# EAGLE design upper (EAGLE 9.4.2)
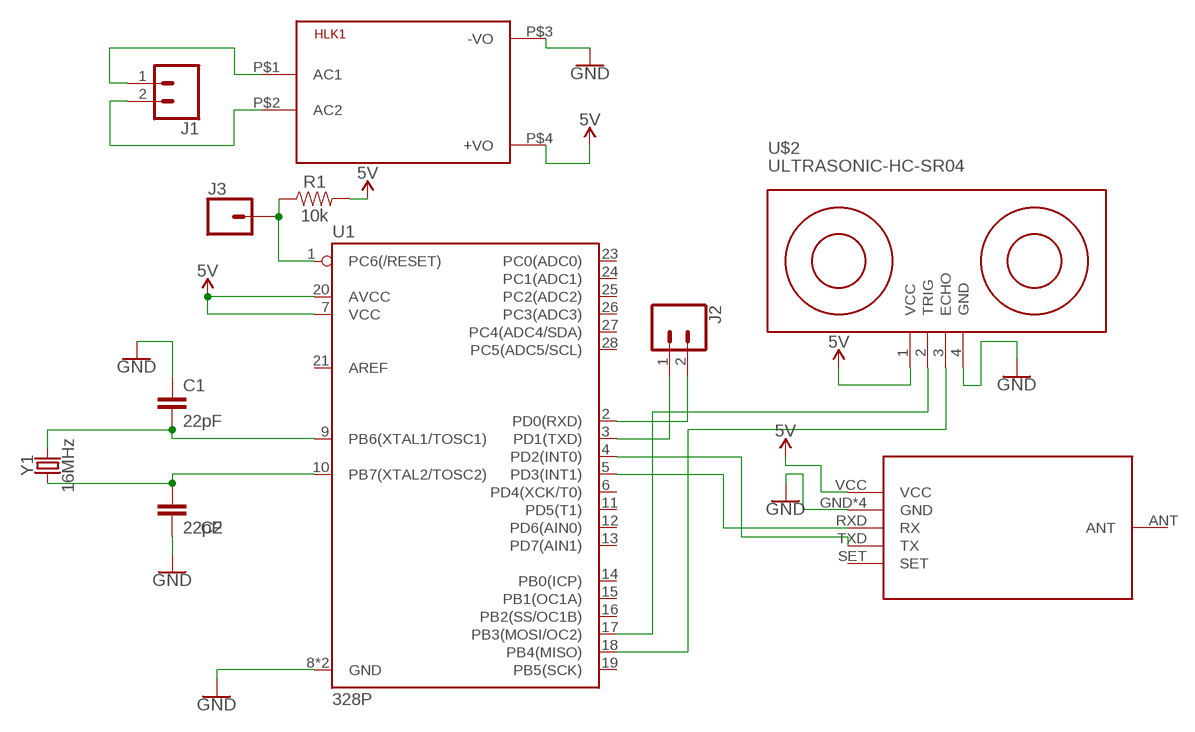
[diagram p0: schematic, sheet 1]

## Parts
C1  22pF  22PF-PTH-2.54MM-200V-5%  [CAP-PTH-2.54]
C2  22pF  22PF-PTH-2.54MM-200V-5%  [CAP-PTH-2.54]
HLK1  HLK-PM013W  [HLK-PM01]
J1  CONN_025MM  [SCREWTERMINAL-5MM-2]
J2  CONN_025MM  [SCREWTERMINAL-5MM-2]
J3  CONN_01  [1X01]
R1  10k  10KOHM-HORIZ-1/4W-1%  [AXIAL-0.3]
U1  328P  ATMEGA328P_PDIP  [DIP28]
U$1  HC-12_FOOTPRINT  [HC-12_FOOTPRINT]
U$2  ULTRASONIC-HC-SR04  [ULTRASONIC-HC-SR04]
Y1  16MHz  CRYSTAL-16MHZPTH-HC49US  [HC49US]

## Nets
5V: HLK1.P$4(+VO) R1.P$2 U1.7(VCC) U1.20(AVCC) U$1.VCC U$2.1(VCC)
GND: C1.1 C2.2 HLK1.P$3(-VO) U1.8(GND) U1.22(GND) U$1.GND U$1.GND1(GND) U$1.GND2(GND) U$1.MCHFIX(GND) U$2.4(GND)
N$1: U1.4(PD2(INT0)) U$1.TXD(TX)
N$2: U1.17(PB3(MOSI/OC2)) U$2.2(TRIG)
N$3: U1.18(PB4(MISO)) U$2.3(ECHO)
N$4: U1.5(PD3(INT1)) U$1.RXD(RX)
N$5: HLK1.P$2(AC2) J1.2
N$6: HLK1.P$1(AC1) J1.1
N$7: J3.1 R1.P$1 U1.1(PC6(/RESET))
N$8: J2.1 U1.3(PD1(TXD))
N$9: J2.2 U1.2(PD0(RXD))
N$10: C1.2 U1.9(PB6(XTAL1/TOSC1)) Y1.2
N$11: C2.1 U1.10(PB7(XTAL2/TOSC2)) Y1.1
Unconnected: U1.6(PD4(XCK/T0)) U1.11(PD5(T1)) U1.12(PD6(AIN0)) U1.13(PD7(AIN1)) U1.14(PB0(ICP)) U1.15(PB1(OC1A)) U1.16(PB2(SS/OC1B)) U1.19(PB5(SCK)) U1.21(AREF) U1.23(PC0(ADC0)) U1.24(PC1(ADC1)) U1.25(PC2(ADC2)) U1.26(PC3(ADC3)) U1.27(PC4(ADC4/SDA)) U1.28(PC5(ADC5/SCL)) U$1.ANT U$1.SET

## Library data of the parts
C1 C2 = SparkFun-Capacitors:22PF: 22pF ceramic capacitors A capacitor is a passive two-terminal electrical component used to store electrical energy temporarily in an electric field.; PROD_ID: CAP-09128
HLK1 = HLK-PM01:HLK-PM01: Hi-Link Power Supply HLK-PM01 3W Author: Ahmed Said <https://github.com/AhmedSaid/EAGLELibraries>
J1 J2 = SparkFun-Connectors:CONN_02: Multi connection point. Often used as Generic Header-pin footprint for 0.1 inch spaced/style header connections On any of the 0.1 inch spaced packages, you can populate with these: Break Away Headers - Straight <https://www.sparkfun.com/products/116> (PRT-00116) Break Away Male Headers - Right Angle <https://www.sparkfun.com/products/553> (PRT-00553) Female Headers <https://www.sparkfun.com/products/115> (PRT-00115) Break Away Headers - Machine Pin <https://www.sparkfun.com/products/117> (PRT-00117) Break Away Female Headers - Swiss Machine Pin <https://www.sparkfun.com/products/743> (PRT-00743) For SCREWTERMINALS and SPRING TERMINALS visit here: Screw Terimnals on SparkFun.com <https://www.sparkfun.com/search/results?term=Screw+Terminals> (5mm/3.5mm/2.54mm spacing) This device is also useful as a general connection point to wire up your design to another part of your project. Our various solder wires solder well into these plated through hole pads. Hook-Up Wire - Assortment (Stranded, 22 AWG) <https://www.sparkfun.com/products/11375> (PRT-11375) Hook-Up Wire - Assortment (Solid Core, 22 AWG) <https://www.sparkfun.com/products/11367> (PRT-11367) View the entire wire category on our website here <https://www.sparkfun.com/categories/141> Special notes: Molex polarized connector foot print use with: PRT-08233 with associated crimp pins and housings. 2.54_SCREWTERM for use with PRT-10571. 3.5mm Screw Terminal footprints for PRT-08084 5mm Screw Terminal footprints for use with PRT-08432; SF_SKU: PRT-08432
J3 = SparkFun-Connectors:CONN_01: Single connection point. Often used as Generic Header-pin footprint for 0.1 inch spaced/style header connections On any of the 0.1 inch spaced packages, you can populate with these: Break Away Headers - Straight <https://www.sparkfun.com/products/116> (PRT-00116) Break Away Male Headers - Right Angle <https://www.sparkfun.com/products/553> (PRT-00553) Female Headers <https://www.sparkfun.com/products/115> (PRT-00115) Break Away Headers - Machine Pin <https://www.sparkfun.com/products/117> (PRT-00117) Break Away Female Headers - Swiss Machine Pin <https://www.sparkfun.com/products/743> (PRT-00743) This device is also useful as a general connection point to wire up your design to another part of your project. Our various solder wires solder well into these plated through hole pads. Hook-Up Wire - Assortment (Stranded, 22 AWG) <https://www.sparkfun.com/products/11375> (PRT-11375) Hook-Up Wire - Assortment (Solid Core, 22 AWG) <https://www.sparkfun.com/products/11367> (PRT-11367) View the entire wire category on our website here <https://www.sparkfun.com/categories/141> Special notes: SMTSO-256-ET is a "flush mount" nut for a 4-40 screw. We mostly use this on specialty testbeds; it is a nice way to connect hardware to your PCB at an adjustable hieght. Also note, the SNAP packages are for using a snappable style connector. We sell a baggie of snaps and they are also used on two LilyPad designs: Snap Assortment - 30 pack (male and female) <https://www.sparkfun.com/products/11347> (DEV-11347) LilyPad Arduino SimpleSnap <https://www.sparkfun.com/products/10941> (DEV-10941) LilyPad SimpleSnap Protoboard <https://www.sparkfun.com/products/10940> (DEV-10940)
R1 = SparkFun-Resistors:10KOHM: 10kΩ resistor A resistor is a passive two-terminal electrical component that implements electrical resistance as a circuit element. Resistors act to reduce current flow, and, at the same time, act to lower voltage levels within circuits. - Wikipedia; PROD_ID: RES-12183
U1 = SparkFun-IC-Microcontroller:ATMEGA328P_PDIP: Atmel 328P Through hole ATMEGA328P uC used in the Arduino 32kb flash, 1k EEPROM, 2k SRAM Datasheet <http://www.sparkfun.com/datasheets/Components/SMD/ATMega328.pdf> SparkFun Products Storefront component: AVR 28 Pin 20MHz 32K 6A/D - ATMega328P <https://www.sparkfun.com/products/9061> (COM-09061) SparkFun Simon Says - Through-Hole Soldering Kit <https://www.sparkfun.com/products/10547> (KIT-10547) SparkFun Learn to Solder - Simon Says <https://www.sparkfun.com/products/13708> (KIT-13708) SparkFun BigTime Watch Kit <https://www.sparkfun.com/products/11734> (KIT-11734) SparkFun ClockIt <https://www.sparkfun.com/products/10930> (KIT-10930) SparkFun Serial Enabled LCD Kit <https://www.sparkfun.com/products/10097> (LCD-10097) SparkFun Simon Tilts - Through Hole Soldering Kit <https://www.sparkfun.com/products/12634> (KIT-12634) SparkFun Frequency Counter Kit <https://www.sparkfun.com/products/10140> (KIT-10140) FabFM Radio Kit <https://www.sparkfun.com/products/11043> (KIT-11043) SparkFun Binary Blaster Kit <https://www.sparkfun.com/products/12037> (KIT-12037) SparkFun Metro-Gnome <https://www.sparkfun.com/products/9236> (KIT-09236) ATmega328 with Arduino Optiboot (Uno) <https://www.sparkfun.com/products/10524> (DEV-10524); PROD_ID: IC-09136
U$1 = hc12_433mhz:HC-12_FOOTPRINT: HC-12 433MHz module footprint MCHFIX is for mechanical fix pin which is NC but on this file connected to GND https://github.com/meendiz/hc-12_si4463/
U$2 = diy-modules:ULTRASONIC-HC-SR04: Ultrasonic Ranging Module HC-SR04 More details available here: http://randomnerdtutorials.com/complete-guide-for-ultrasonic-sensor-hc-sr04/ Click here to find device on ebay.com <http://www.ebay.com/sch/hc+sr04+ultrasonic>
Y1 = SparkFun-Clocks:CRYSTAL-16MHZ: 16MHz Crystal Digikey Example <http://www.digikey.com/product-search/en?keywords=535-9122-1-ND> Frequency: 16MHz Frequency Stability: ±50ppm Frequency Tolerance: ±20ppm Load Capacitance: 18pF SparkFun Products: Pro Micro -5V/16MHz <https://www.sparkfun.com/products/12640> SparkFun Serial Enabled LCD Kit <https://www.sparkfun.com/products/10097>; PROD_ID: XTAL-08181; SF_ID: COM-00536

## Board
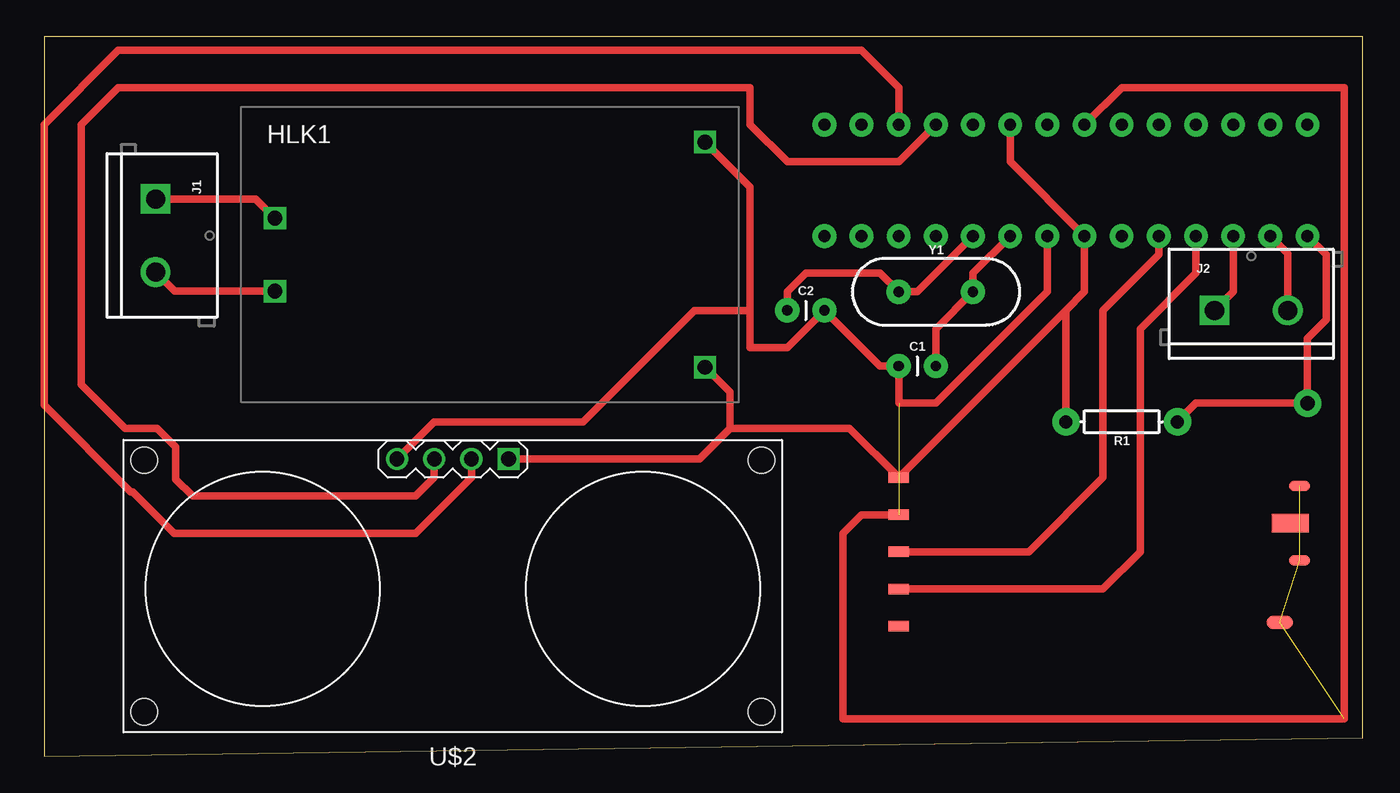
[diagram p1: board, top side]
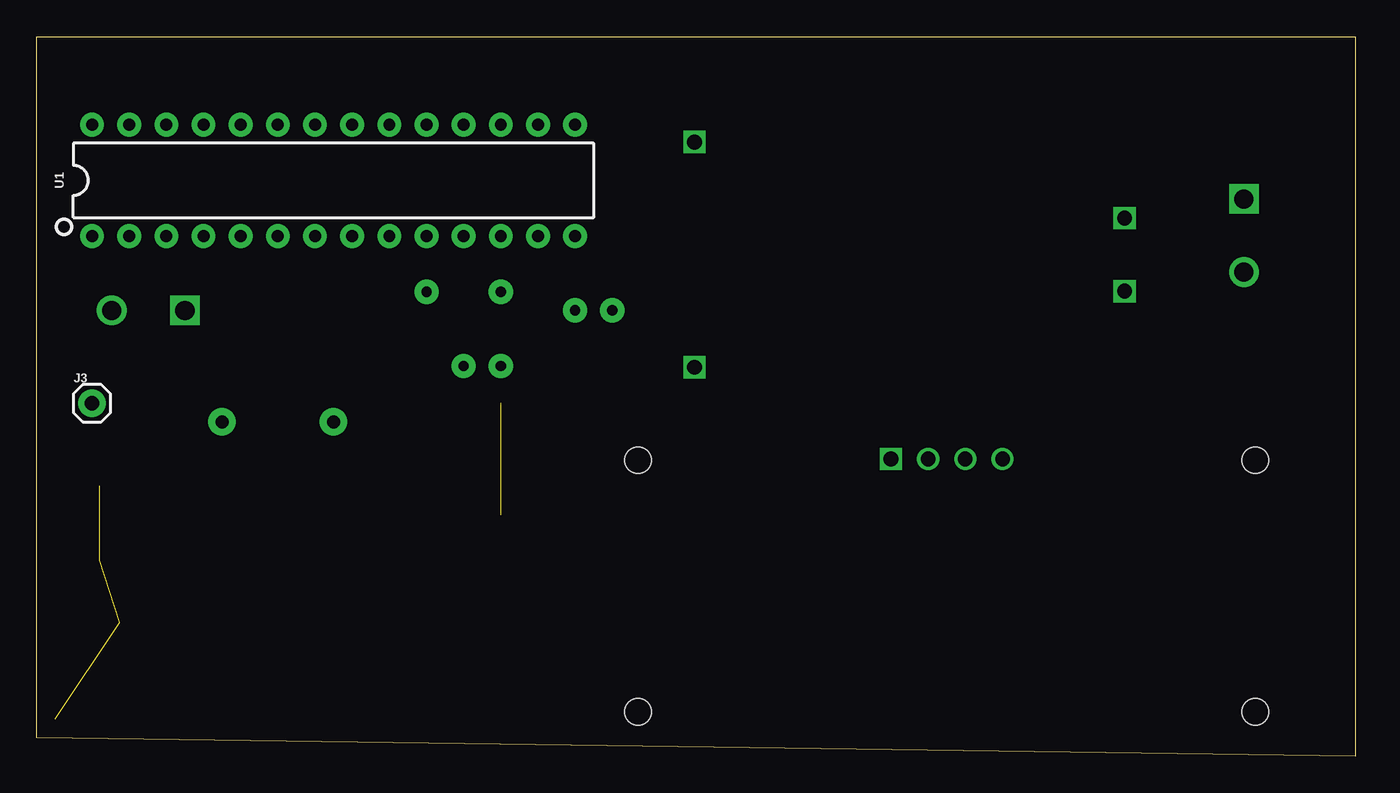
[diagram p2: board, bottom side, seen from below]

Size 90.15 x 49.2 mm. Coordinates in mm from the lower left corner, seen from the top.
Outline: 0,0 90.15,1.27 90.15,49.2 0,49.2 0,0
Copper layers (1*16): Top 0.035mm / dielectric 1.5mm / Bottom 0.035mm
Design rules "default": minimum track width 6mil, minimum drill 0.35mm, track to track 6mil, track to pad 6mil, pad to pad 6mil, via to via 6mil, smd to smd 6mil, copper to edge 40mil, drill to drill 6mil, minimum pad ring 10mil, minimum via ring 8mil, stop-mask expansion 4mil, vias tented up to drill 0mil, thermal gap 10mil

### Footprints (pad centres in the part's own frame; a part is rotated, then mirrored left to right if it is on the bottom)
CAP-PTH-2.54 = drill 0.7 pad 1.651: 1 -1.27,0; 2 1.27,0
HLK-PM01 = drill 1.016 square: P$1 -14.7,2.5; P$2 -14.7,-2.5; P$3 14.7,7.7; P$4 14.7,-7.7
SCREWTERMINAL-5MM-2 = drill 1.3 pad 2.032 square: 1 0,0 | drill 1.3 pad 2.032: 2 5,0
1X01 = drill 1.016 pad 1.88: 1 0,0
AXIAL-0.3 = drill 0.9 pad 1.88: P$1 -3.81,0; P$2 3.81,0
DIP28 = drill 0.813 pad 1.626: 1 -16.51,-3.81; 2 -13.97,-3.81; 3 -11.43,-3.81; 4 -8.89,-3.81; 5 -6.35,-3.81; 6 -3.81,-3.81; 7 -1.27,-3.81; 8 1.27,-3.81; 9 3.81,-3.81; 10 6.35,-3.81; 11 8.89,-3.81; 12 11.43,-3.81; 13 13.97,-3.81; 14 16.51,-3.81; 15 16.51,3.81; 16 13.97,3.81; 17 11.43,3.81; 18 8.89,3.81; 19 6.35,3.81; 20 3.81,3.81; 21 1.27,3.81; 22 -1.27,3.81; 23 -3.81,3.81; 24 -6.35,3.81; 25 -8.89,3.81; 26 -11.43,3.81; 27 -13.97,3.81; 28 -16.51,3.81
HC-12_FOOTPRINT = smd 2.54 x 1.27: ANT 25.49,7.03 | smd 1.422 x 0.711: GND -1.27,7.62; GND1 26.13,9.57; GND2 26.13,4.49; RXD -1.27,5.08; SET -1.27,0; TXD -1.27,2.54; VCC -1.27,10.16 | smd 1.778 x 0.914: MCHFIX 24.78,0.25
ULTRASONIC-HC-SR04 = drill 1 square: 1 -3.81,-8.89 | drill 1: 2 -1.27,-8.89; 3 1.27,-8.89; 4 3.81,-8.89 | hole 1.8: -21.1,8.4; -21.1,-8.8; 21.1,-8.8; 21.1,8.4
HC49US = drill 0.7 pad 1.651: 1 -2.54,0; 2 2.54,0

### Placement (x,y rotation side)
C1  59.69,26.67 0 top
C2  52.07,30.48 0 top
HLK1  30.48,34.29 0 top
J1  7.62,38.1 270 top
J2  80.01,30.48 0 top
J3  86.36,24.13 0 bottom
R1  73.66,22.86 180 top
U1  69.85,39.37 0 bottom
U$1  59.69,8.89 0 top
U$2  27.94,11.43 180 top
Y1  60.96,31.75 0 top

### Tracks (layer width: path | path; a pad name or v marks a point on that pad's centre or on a via)
5V
  Top 0.508: 69.85,30.48 U$1.VCC 55.07,22.4 46.87,22.4 | 69.85,30.48 71.12,31.75 U1.7 66.04,40.64 U1.20 | U$2.1 44.79,20.32 46.87,22.4 | HLK1.P$4 46.87,24.9 46.87,22.4 | R1.P$2 69.85,30.48
GND  (4 unrouted)
  Top 0.508: U$1.GND 55.88,16.51 54.61,15.24 54.61,2.54 88.88,2.54 88.88,45.72 73.66,45.72 U1.22 | U1.8 68.58,31.75 60.96,24.13 58.42,24.13 C1.1 57.15,26.67 C2.2 50.8,27.94 48.26,27.94 48.26,30.48 | HLK1.P$3 48.26,38.91 48.26,30.48 | U$2.4 26.67,22.86 36.83,22.86 44.45,30.48 48.26,30.48
N$1
  Top 0.508: U1.4 78.74,33.02 74.93,29.21 74.93,13.97 72.39,11.43 U$1.TXD
N$2
  Top 0.508: U1.17 58.42,45.72 55.88,48.26 5.08,48.26 0,43.18 0,24 5.94,18.06 6.07,18.06 8.89,15.24 25.4,15.24 29.21,19.05 U$2.2
N$3
  Top 0.508: U1.18 58.42,40.64 50.8,40.64 48.26,43.18 48.26,45.72 5.08,45.72 2.54,43.18 2.54,25.4 5.54,22.4 7.74,22.4 9.01,21.13 9.01,18.93 10.16,17.78 25.4,17.78 26.67,19.05 U$2.3
N$4
  Top 0.508: U1.5 76.2,34.29 72.39,30.48 72.39,19.05 67.31,13.97 U$1.RXD
N$5
  Top 0.508: J1.2 8.93,31.79 HLK1.P$2
N$6
  Top 0.508: HLK1.P$1 14.47,38.1 J1.1
N$7  (via drill 0.35)
  Top 0.508: U1.1 87.63,34.29 87.63,29.87 87.66,29.84 86.36,28.55 J3.1 78.74,24.13 R1.P$1
  other vias: 77.47,22.86
N$8
  Top 0.508: U1.3 81.28,31.75 J2.1
N$9
  Top 0.508: U1.2 85.01,34.37 J2.2
N$10
  Top 0.508: U1.9 63.5,33.02 Y1.2 60.96,29.21 C1.2
N$11
  Top 0.508: U1.10 59.69,31.75 Y1.1 57.15,33.02 52.07,33.02 50.8,31.75 C2.1